# EAGLE schematic real_with_onsemi (EAGLE 9.3.0)
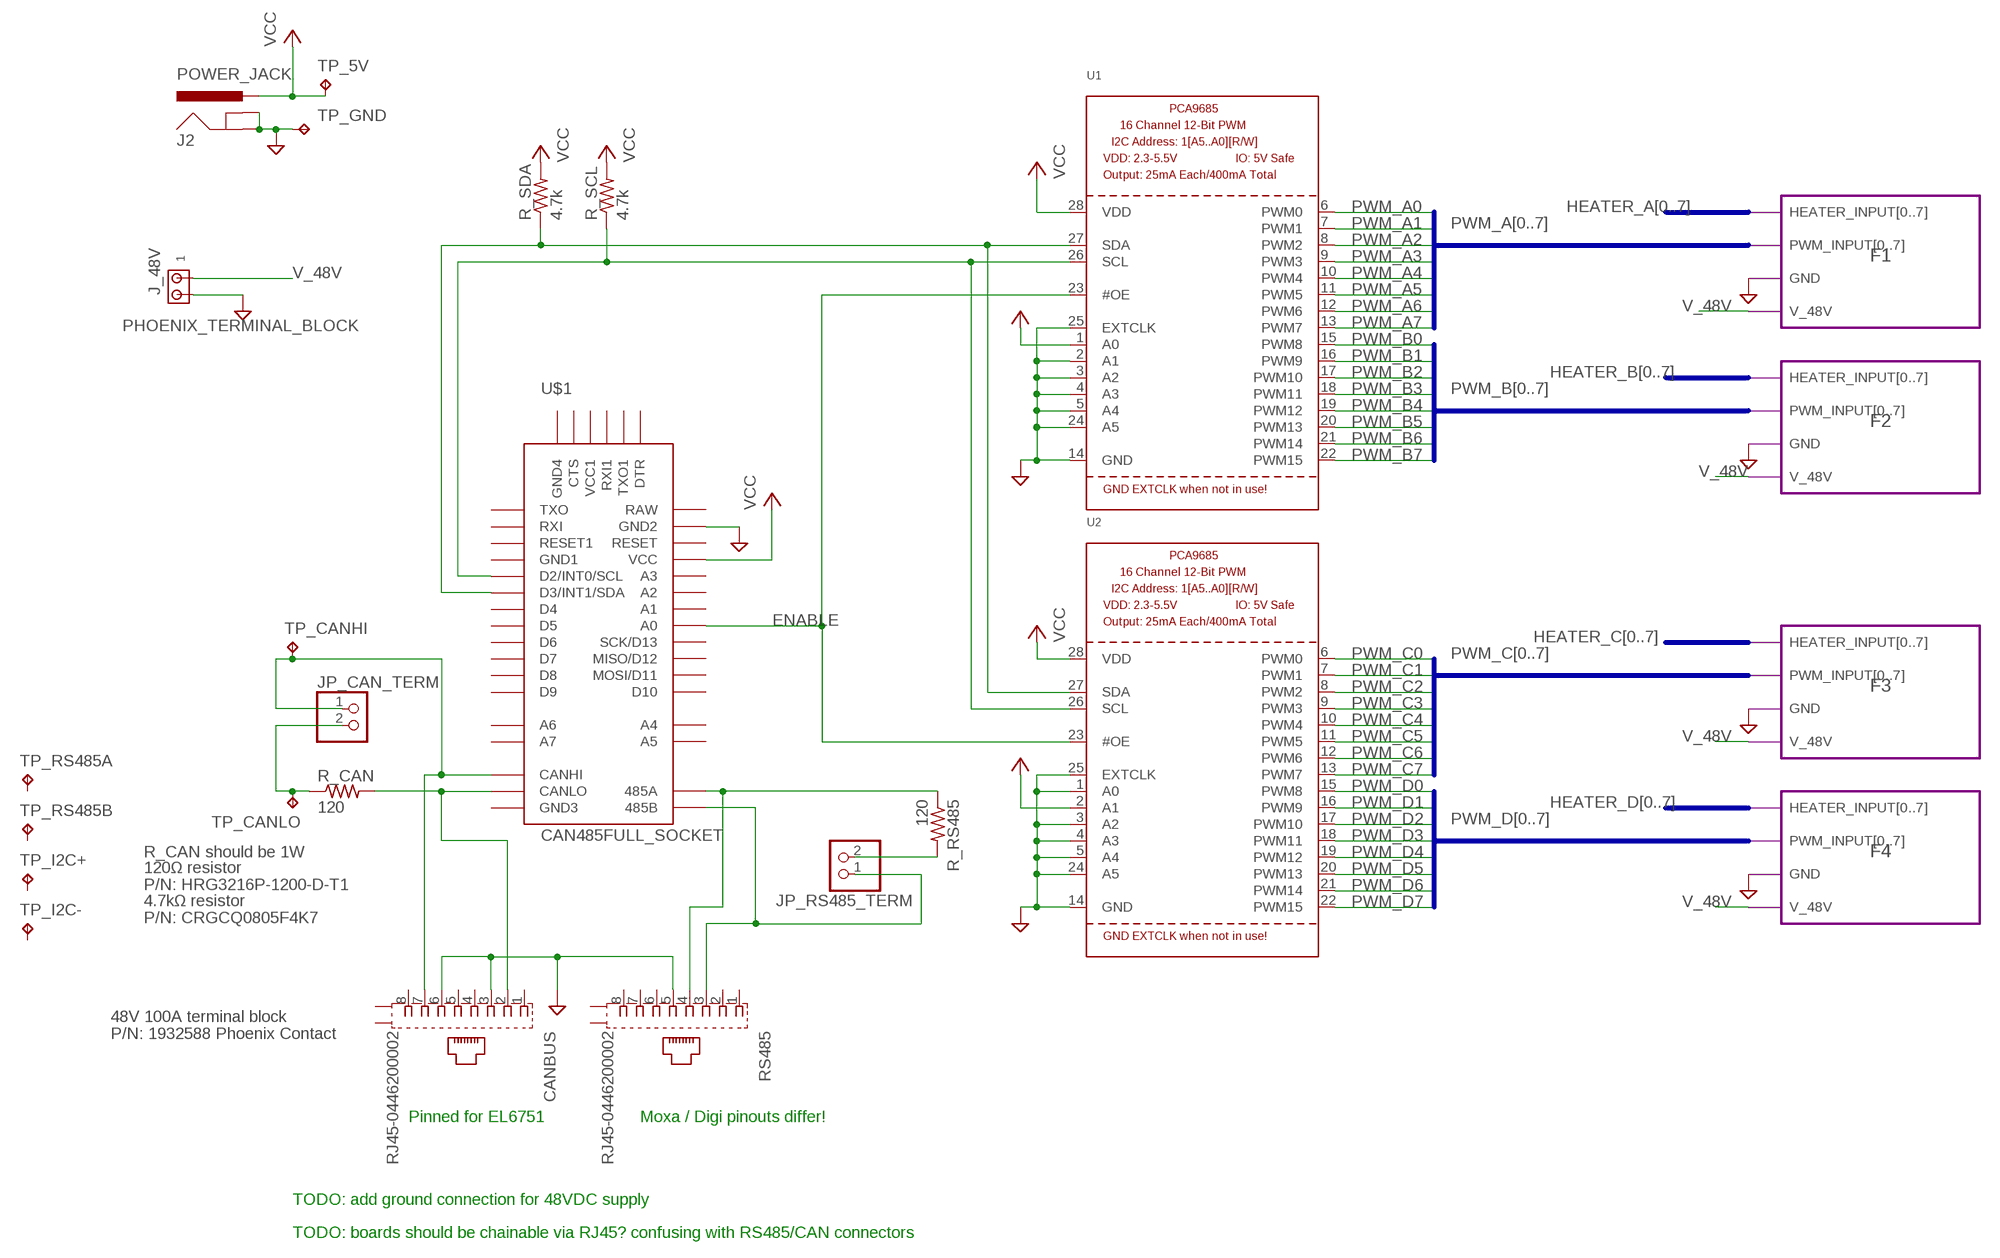
[diagram p0: schematic, sheet 1]

## Parts
CANBUS  RJ45-0446200002  [0446200002]
J2  POWER_JACK  [POWER_JACK_PTH]
J_48V  PHOENIX_TERMINAL_BLOCK  [TERMINAL_BLOCK_PHOENIX]
JP_CAN_TERM  PINHD-1X2  [1X02]
JP_RS485_TERM  PINHD-1X2  [1X02]
R_CAN  120  R-US_R1206  [R1206]
R_RS485  120  R-US_R1206  [R1206]
R_SCL  4.7k  R-US_R0805  [R0805]
R_SDA  4.7k  R-US_R0805  [R0805]
RS485  RJ45-0446200002  [0446200002]
TP_5V  TPB1,27  [B1,27]
TP_CANHI  TPB1,27  [B1,27]
TP_CANLO  TPB1,27  [B1,27]
TP_GND  TPB1,27  [B1,27]
TP_I2C+  TPB1,27  [B1,27]
TP_I2C-  TPB1,27  [B1,27]
TP_RS485A  TPB1,27  [B1,27]
TP_RS485B  TPB1,27  [B1,27]
U1  PCA9685  [TSSOP28]
U2  PCA9685  [TSSOP28]
U$1  CAN485FULL_SOCKET  [CAN485]

## Module instances
F1 = FET8
F2 = FET8
F3 = FET8
F4 = FET8

## Nets
ENABLE: U1.23(#OE) U2.23(#OE) U$1.A0
GND: CANBUS.3 CANBUS.6 J2.GND J2.GNDBREAK J_48V.P$3 J_48V.P$4 J_48V.P$7 J_48V.P$8 RS485.5 TP_GND.TP U1.2(A1) U1.3(A2) U1.4(A3) U1.5(A4) U1.14(GND) U1.24(A5) U1.25(EXTCLK) U2.1(A0) U2.3(A2) U2.4(A3) U2.5(A4) U2.14(GND) U2.24(A5) U2.25(EXTCLK) U$1.GND2 ; port F1.GND F2.GND F3.GND F4.GND
N$1: JP_CAN_TERM.2 R_CAN.1 TP_CANLO.TP
N$3: CANBUS.7 JP_CAN_TERM.1 TP_CANHI.TP U$1.CANHI
N$4: CANBUS.2 R_CAN.2 U$1.CANLO
N$5: R_RS485.1 RS485.4 U$1.485A
N$6: JP_RS485_TERM.2 R_RS485.2
N$7: JP_RS485_TERM.1 RS485.3 U$1.485B
N$16: R_SCL.1 U1.26(SCL) U2.26(SCL) U$1.2(D2/INT0/SCL)
N$19: R_SDA.1 U1.27(SDA) U2.27(SDA) U$1.3(D3/INT1/SDA)
PWM_A0: U1.6(PWM0)
PWM_A1: U1.7(PWM1)
PWM_A2: U1.8(PWM2)
PWM_A3: U1.9(PWM3)
PWM_A4: U1.10(PWM4)
PWM_A5: U1.11(PWM5)
PWM_A6: U1.12(PWM6)
PWM_A7: U1.13(PWM7)
PWM_B0: U1.15(PWM8)
PWM_B1: U1.16(PWM9)
PWM_B2: U1.17(PWM10)
PWM_B3: U1.18(PWM11)
PWM_B4: U1.19(PWM12)
PWM_B5: U1.20(PWM13)
PWM_B6: U1.21(PWM14)
PWM_B7: U1.22(PWM15)
PWM_C0: U2.6(PWM0)
PWM_C1: U2.7(PWM1)
PWM_C2: U2.8(PWM2)
PWM_C3: U2.9(PWM3)
PWM_C4: U2.10(PWM4)
PWM_C5: U2.11(PWM5)
PWM_C6: U2.12(PWM6)
PWM_C7: U2.13(PWM7)
PWM_D0: U2.15(PWM8)
PWM_D1: U2.16(PWM9)
PWM_D2: U2.17(PWM10)
PWM_D3: U2.18(PWM11)
PWM_D4: U2.19(PWM12)
PWM_D5: U2.20(PWM13)
PWM_D6: U2.21(PWM14)
PWM_D7: U2.22(PWM15)
V_48V: J_48V.P$1 J_48V.P$2 J_48V.P$5 J_48V.P$6 ; port F1.V_48V F2.V_48V F3.V_48V F4.V_48V
VCC: J2.PWR R_SCL.2 R_SDA.2 TP_5V.TP U1.1(A0) U1.28(VDD) U2.2(A1) U2.28(VDD) U$1.VCC
Unconnected: CANBUS.1 CANBUS.4 CANBUS.5 CANBUS.8 CANBUS.S@1(S1) CANBUS.S@2(S2) RS485.1 RS485.2 RS485.6 RS485.7 RS485.8 RS485.S@1(S1) RS485.S@2(S2) TP_I2C+.TP TP_I2C-.TP TP_RS485A.TP TP_RS485B.TP U$1.4(D4) U$1.5(D5) U$1.6(D6) U$1.7(D7) U$1.8(D8) U$1.9(D9) U$1.10(D10) U$1.11(MOSI/D11) U$1.12(MISO/D12) U$1.13(SCK/D13) U$1.A1 U$1.A2 U$1.A3 U$1.A4 U$1.A5 U$1.A6 U$1.A7 U$1.CTS U$1.DTR U$1.GND1 U$1.GND3 U$1.GND4 U$1.RAW U$1.RST1(RESET1) U$1.RST(RESET) U$1.RXI U$1.RXI1 U$1.TXO U$1.TXO1 U$1.VCC1

## Buses
HEATER_A[0..7]
PWM_A[0..7]
HEATER_B[0..7]
PWM_B[0..7]
HEATER_C[0..7]
PWM_C[0..7]
HEATER_D[0..7]
PWM_D[0..7]

## Notes on the sheet
- R_CAN should be 1W
- 120Ω resistor
  P/N: HRG3216P-1200-D-T1
- 4.7kΩ resistor
  P/N: CRGCQ0805F4K7
- 48V 100A terminal block 
  P/N: 1932588 Phoenix Contact
- Pinned for EL6751 | Moxa / Digi pinouts differ!
- TODO: add ground connection for 48VDC supply
- TODO: boards should be chainable via RJ45? confusing with RS485/CAN connectors

## Library data of the parts
CANBUS RS485 = real_library:RJ45-0446200002: RJ-45 INVERTED MODULAR JACK ASSEMBLY WITH RJ-11 KEEPOUT FEATURE Source: Data sheet <http://www.farnell.com/datasheets/73207.pdf> MOLEX 0446200002 BUCHSE, RJ45, GESCHIRMT Source: Farnell <http://de.farnell.com/molex/0446200002/buchse-rj45-geschirmt/dp/9251910?ost=9251910>; MF: MOLEX; MPN: 0446200002; OC_FARNELL: 9251910
J2 = real_library:POWER_JACK: Power Jack Connector This is the standard 5.5mm barrel jack for power. The PTH is the most common, proven, reliable, footprint. The Slot footprint only works if the mill layer is transmitted to the PCB fab house so be warned. Here are the connectors we sell at SparkFun: DC Barrel Power Jack/Connector <https://www.sparkfun.com/products/119> (PRT-00119) DC Barrel Power Jack/Connector (SMD) <https://www.sparkfun.com/products/12748> (PRT-12748) DC Barrel Jack Adapter - Breadboard Compatible <https://www.sparkfun.com/products/10811> (PRT-10811) It is used on this SparkFun product (and many, many others): SparkFun RedBoard - Programmed with Arduino <https://www.sparkfun.com/products/12757> (DEV-12757) Also, if you need a mating power supply or connector, please check these out: Wall Adapter Power Supply - 9VDC 650mA <https://www.sparkfun.com/products/298> (TOL-00298) DC Barrel Jack Adapter - Male <https://www.sparkfun.com/products/10287> (PRT-10287); PROD_ID: CONN-08197
J_48V = real_library:PHOENIX_TERMINAL_BLOCK
JP_CAN_TERM JP_RS485_TERM = pinhead:PINHD-1X2: PIN HEADER
R_CAN R_RS485 R_SCL R_SDA = rcl:R-US_: RESISTOR, American symbol; SPICEPREFIX: R
TP_5V TP_CANHI TP_CANLO TP_GND TP_I2C+ TP_I2C- TP_RS485A TP_RS485B = testpad:TP: Test pad
U1 U2 = real_library:PCA9685: PCA9685 - 16 Channel 12-Bit I2C PWM Controller 5.0V tolerant 16 channel, 12-bit I2C PWM controller with 25mA per output (max. 400mA total) Digikey: 568-5931-1-ND
U$1 = real_library:CAN485

## Module FET8
Ports: HEATER_INPUT[0..7](io) PWM_INPUT[0..7](io) GND(io) V_48V(io)
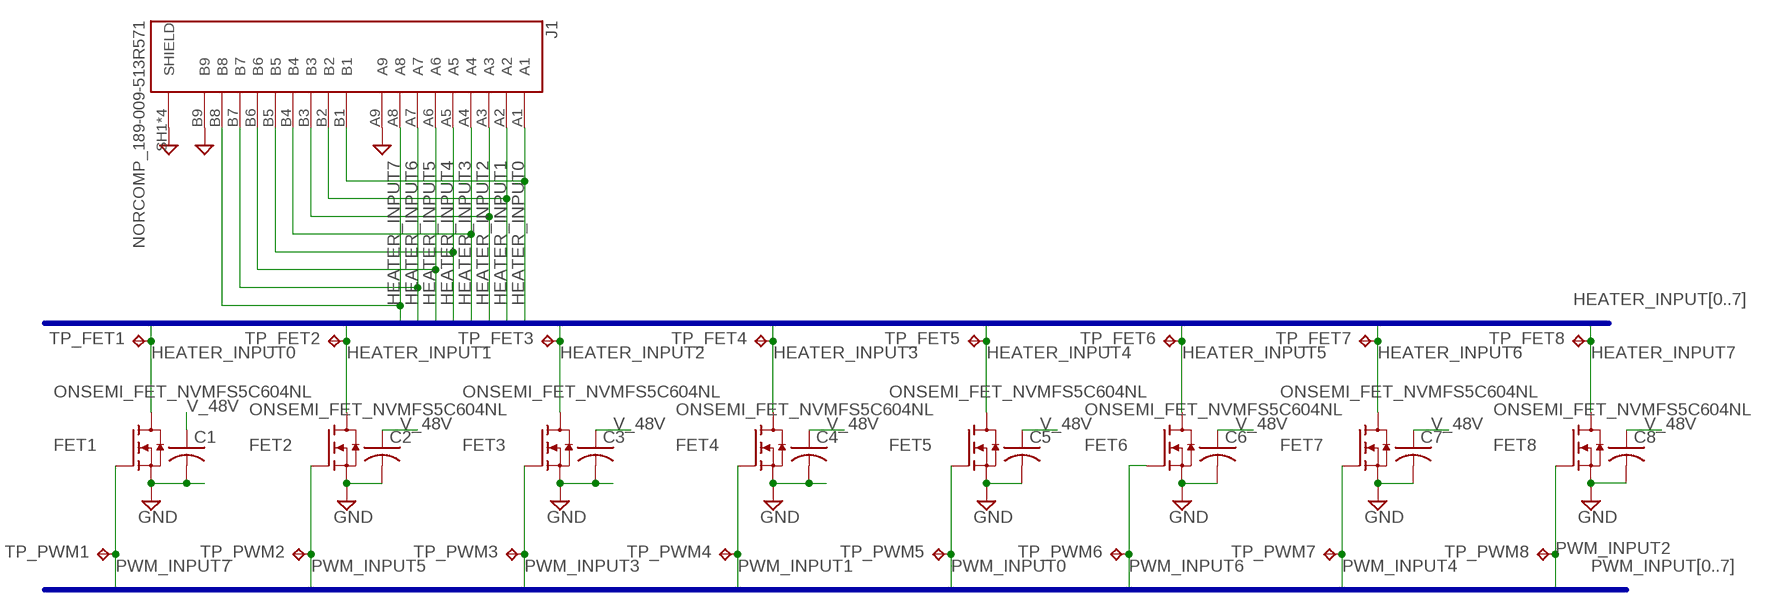
[diagram p1: schematic, module FET8, sheet 1]

### Parts
C1  C-USC0805  [C0805]
C2  C-USC0805  [C0805]
C3  C-USC0805  [C0805]
C4  C-USC0805  [C0805]
C5  C-USC0805  [C0805]
C6  C-USC0805  [C0805]
C7  C-USC0805  [C0805]
C8  C-USC0805  [C0805]
FET1  ONSEMI_FET_NVMFS5C604NL  [DFN500X600X110-5N]
FET2  ONSEMI_FET_NVMFS5C604NL  [DFN500X600X110-5N]
FET3  ONSEMI_FET_NVMFS5C604NL  [DFN500X600X110-5N]
FET4  ONSEMI_FET_NVMFS5C604NL  [DFN500X600X110-5N]
FET5  ONSEMI_FET_NVMFS5C604NL  [DFN500X600X110-5N]
FET6  ONSEMI_FET_NVMFS5C604NL  [DFN500X600X110-5N]
FET7  ONSEMI_FET_NVMFS5C604NL  [DFN500X600X110-5N]
FET8  ONSEMI_FET_NVMFS5C604NL  [DFN500X600X110-5N]
J1  NORCOMP_189-009-513R571  [NORCOMP_189-009-513R571]
TP_FET1  TPB1,27  [B1,27]
TP_FET2  TPB1,27  [B1,27]
TP_FET3  TPB1,27  [B1,27]
TP_FET4  TPB1,27  [B1,27]
TP_FET5  TPB1,27  [B1,27]
TP_FET6  TPB1,27  [B1,27]
TP_FET7  TPB1,27  [B1,27]
TP_FET8  TPB1,27  [B1,27]
TP_PWM1  TPB1,27  [B1,27]
TP_PWM2  TPB1,27  [B1,27]
TP_PWM3  TPB1,27  [B1,27]
TP_PWM4  TPB1,27  [B1,27]
TP_PWM5  TPB1,27  [B1,27]
TP_PWM6  TPB1,27  [B1,27]
TP_PWM7  TPB1,27  [B1,27]
TP_PWM8  TPB1,27  [B1,27]

### Nets
GND [heaters]: C1.2 C2.2 C3.2 C4.2 C5.2 C6.2 C7.2 C8.2 FET1.1(S) FET1.2(S) FET1.3(S) FET2.1(S) FET2.2(S) FET2.3(S) FET3.1(S) FET3.2(S) FET3.3(S) FET4.1(S) FET4.2(S) FET4.3(S) FET5.1(S) FET5.2(S) FET5.3(S) FET6.1(S) FET6.2(S) FET6.3(S) FET7.1(S) FET7.2(S) FET7.3(S) FET8.1(S) FET8.2(S) FET8.3(S) J1.A9 J1.B9 J1.SH1(SHIELD) J1.SH2(SHIELD) J1.SH3(SHIELD) J1.SH4(SHIELD)
HEATER_INPUT0 [heaters]: FET1.5@1(D) FET1.5@2(D) FET1.5@3(D) FET1.5@4(D) FET1.5@5(D) J1.A1 J1.B1 TP_FET1.TP
HEATER_INPUT1 [heaters]: FET2.5@1(D) FET2.5@2(D) FET2.5@3(D) FET2.5@4(D) FET2.5@5(D) J1.A2 J1.B2 TP_FET2.TP
HEATER_INPUT2 [heaters]: FET3.5@1(D) FET3.5@2(D) FET3.5@3(D) FET3.5@4(D) FET3.5@5(D) J1.A3 J1.B3 TP_FET3.TP
HEATER_INPUT3 [heaters]: FET4.5@1(D) FET4.5@2(D) FET4.5@3(D) FET4.5@4(D) FET4.5@5(D) J1.A4 J1.B4 TP_FET4.TP
HEATER_INPUT4 [heaters]: FET5.5@1(D) FET5.5@2(D) FET5.5@3(D) FET5.5@4(D) FET5.5@5(D) J1.A5 J1.B5 TP_FET5.TP
HEATER_INPUT5 [heaters]: FET6.5@1(D) FET6.5@2(D) FET6.5@3(D) FET6.5@4(D) FET6.5@5(D) J1.A6 J1.B6 TP_FET6.TP
HEATER_INPUT6 [heaters]: FET7.5@1(D) FET7.5@2(D) FET7.5@3(D) FET7.5@4(D) FET7.5@5(D) J1.A7 J1.B7 TP_FET7.TP
HEATER_INPUT7 [heaters]: FET8.5@1(D) FET8.5@2(D) FET8.5@3(D) FET8.5@4(D) FET8.5@5(D) J1.A8 J1.B8 TP_FET8.TP
PWM_INPUT0: FET5.4(G) TP_PWM5.TP
PWM_INPUT1: FET4.4(G) TP_PWM4.TP
PWM_INPUT2: FET8.4(G) TP_PWM8.TP
PWM_INPUT3: FET3.4(G) TP_PWM3.TP
PWM_INPUT4: FET7.4(G) TP_PWM7.TP
PWM_INPUT5: FET2.4(G) TP_PWM2.TP
PWM_INPUT6: FET6.4(G) TP_PWM6.TP
PWM_INPUT7: FET1.4(G) TP_PWM1.TP
V_48V [heaters]: C1.1 C2.1 C3.1 C4.1 C5.1 C6.1 C7.1 C8.1

### Buses
PWM_INPUT[0..7]
HEATER_INPUT[0..7]

### Library data of the parts
C1-C8 = rcl:C-US: CAPACITOR, American symbol; SPICEPREFIX: C
FET1-FET8 = real_library:ONSEMI_FET_NVMFS5C604NL: NVMFS5C604NL: Power MOSFET 60 V, 1.2 m, 287 A, Single N−Channel
J1 = real_library:NORCOMP_189-009-513R571: CONN D-SUB RCPT 9POS R/A SLDR; AVAILABILITY: Unavailable; DESCRIPTION: Conn D-Subminiature F/F 9/9 POS 2.77mm Solder RA Thru-Hole 18 Terminal 2 Port; MF: NorComp Inc.; MP: 189-009-513R571; PACKAGE: None; PRICE: None
TP_FET1-TP_FET8 TP_PWM1-TP_PWM8 = testpad:TP: Test pad

## Net classes
1 heater: width 0.457 mm, clearance 0.254 mm
10 heaters: width 0.457 mm, clearance 0.254 mm